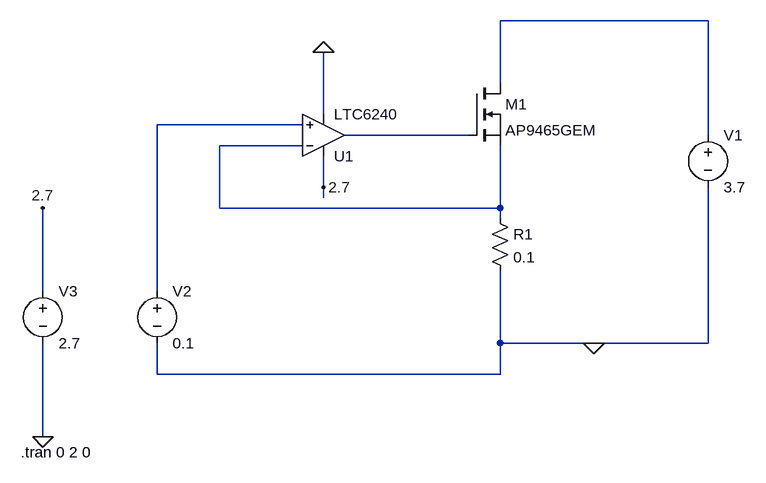
[diagram p0: schematic current_sink.asc]
current_sink.asc, the LTspice schematic file:
Version 4
SHEET 1 880 680
WIRE 752 -64 432 -64
WIRE 432 32 432 -64
WIRE 160 80 160 -16
WIRE 128 96 -96 96
WIRE 384 112 192 112
WIRE 752 112 752 -64
WIRE 128 128 0 128
WIRE 160 192 160 144
WIRE 160 208 160 192
WIRE 0 224 0 128
WIRE 432 224 432 128
WIRE 432 224 0 224
WIRE 432 240 432 224
WIRE -272 352 -272 224
WIRE -96 352 -96 96
WIRE 432 432 432 320
WIRE 576 432 432 432
WIRE 752 432 752 192
WIRE 752 432 576 432
WIRE -96 480 -96 432
WIRE 432 480 432 432
WIRE 432 480 -96 480
WIRE -272 576 -272 432
FLAG -272 224 2.7
FLAG 576 432 0
FLAG -272 576 0
FLAG 160 192 2.7
FLAG 160 -16 0
SYMBOL Opamps\\LTC6240 160 112 M180
SYMATTR InstName U1
SYMBOL res 416 224 R0
SYMATTR InstName R1
SYMATTR Value 0.1
SYMBOL nmos 384 32 R0
SYMATTR InstName M1
SYMATTR Value AP9465GEM
SYMBOL voltage 752 96 R0
WINDOW 123 0 0 Left 2
WINDOW 39 0 0 Left 2
SYMATTR InstName V1
SYMATTR Value 3.7
SYMBOL voltage -96 336 R0
WINDOW 123 0 0 Left 2
WINDOW 39 0 0 Left 2
SYMATTR InstName V2
SYMATTR Value 0.1
SYMBOL voltage -272 336 R0
WINDOW 123 0 0 Left 2
WINDOW 39 0 0 Left 2
SYMATTR InstName V3
SYMATTR Value 2.7
TEXT -306 600 Left 2 !.tran 0 2 0

The netlist it stands for:
* current_sink.asc
* U1: LTC6240 (symbol Opamps\LTC6240 not available, pins judged from their places): In+=N002 In-=N004 V+=2.7 V-=0 OUT=N003
R1 N004 0 0.1
M1 N001 N003 N004 N004 AP9465GEM
V1 N001 0 3.7
V2 N002 0 0.1
V3 2.7 0 2.7
.model NMOS NMOS
.model PMOS PMOS
.lib standard.mos
.tran 0 2 0
.backanno
.end